# EAGLE design V100_Roco_68826_21MTC_J2_029_01_04 (EAGLE 5.10)
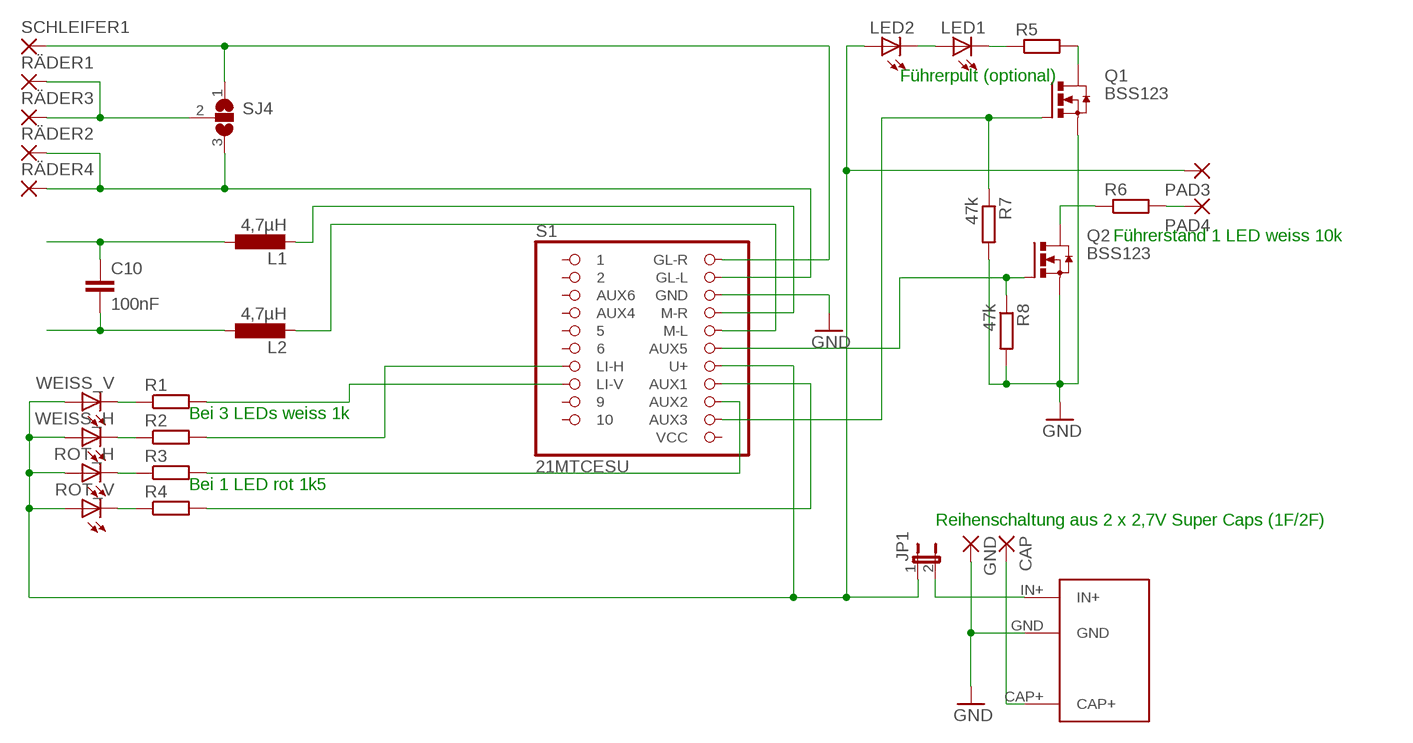
[diagram p0: schematic, sheet 1]

## Parts
C10  100nF  C-EUC0603  [C0603]
CAP  SMD2  [SMD1,27-2,54]
GND  SMD2  [SMD1,27-2,54]
JP1  JP1E2,00  [JP1_2]
L1  4,7µH  L-EUL1212W  [L1212W]
L2  4,7µH  L-EUL1212W  [L1212W]
LED1  LEDCHIPLED_0603  [CHIPLED_0603]
LED2  LEDCHIPLED_0603  [CHIPLED_0603]
PAD3  SMD-LONG1,27-1,9  [SMD1,27-1,9]
PAD4  SMD-LONG1,27-1,9  [SMD1,27-1,9]
Q1  BSS123  N-HEXFET_SOT23-  [SOT23]
Q2  BSS123  N-HEXFET_SOT23-  [SOT23]
R1  R-EU_R0603  [R0603]
R2  R-EU_R0603  [R0603]
R3  R-EU_R0603  [R0603]
R4  R-EU_R0603  [R0603]
R5  R-EU_R0603  [R0603]
R6  R-EU_R0603  [R0603]
R7  47k  R-EU_R0603  [R0603]
R8  47k  R-EU_R0603  [R0603]
ROT_H  LG_T679-F1G2-1  [PLCC2]
ROT_V  LG_T679-F1G2-1  [PLCC2]
RÄDER1  SMD2  [SMD1,27-2,54]
RÄDER2  SMD2  [SMD1,27-2,54]
RÄDER3  SMD2  [SMD1,27-2,54]
RÄDER4  SMD2  [SMD1,27-2,54]
S1  21MTCESU  [21MTC_SMD_ESU]
SCHLEIFER1  SMD2  [SMD1,27-2,54]
SJ4  SJ2W  [SJ_2]
U$3  PWR_CAPT  [POWER_CAP]
WEISS_H  LG_T679-F1G2-1  [PLCC2]
WEISS_V  LG_T679-F1G2-1  [PLCC2]

## Nets
AUX1: R4.2 S1.P15(AUX1)
AUX2: R3.2 S1.P14(AUX2)
AUX3: Q1.3(D) R5.2
AUX5: Q2.1(G) R8.1 S1.P17(AUX5)
BLAU: C10.1 L1.1
CAP: CAP.1(P) U$3.CAP+
GELB: R2.2 S1.P7(LI-H)
GND: GND.1(P) Q1.2(S) Q2.2(S) R7.2 R8.2 S1.P20(GND) U$3.GND
GRAU: R1.2 S1.P8(LI-V)
GRÜN: C10.2 L2.1
IN: JP1.2 U$3.IN+
N$1: R1.1 WEISS_V.C
N$2: R2.1 WEISS_H.C
N$3: R3.1 ROT_H.C
N$4: R4.1 ROT_V.C
N$6: LED1.A LED2.C
N$7: LED1.C R5.1
N$8: Q1.1(G) R7.1 S1.P13(AUX3)
N$9: Q2.3(D) R6.1
N$10: PAD4.1(P) R6.2
N$22: L2.2 S1.P18(M-L)
N$23: L1.2 S1.P19(M-R)
ORANGE: JP1.1 LED2.A PAD3.1(P) ROT_H.A ROT_V.A S1.P16(U+) WEISS_H.A WEISS_V.A
RÄDER: RÄDER2.1(P) RÄDER4.1(P) S1.P21(GL-L) SJ4.3
RÄDER2: RÄDER1.1(P) RÄDER3.1(P) SJ4.2
SCHLEIFER: S1.P22(GL-R) SCHLEIFER1.1(P) SJ4.1
Unconnected: S1.P1 S1.P2 S1.P3(AUX6) S1.P4(AUX4) S1.P5 S1.P6 S1.P9 S1.P10

## Notes on the sheet
- Führerpult (optional)
- Führerstand 1 LED weiss 10k
- Bei 3 LEDs weiss 1k
- Bei 1 LED rot 1k5
- Reihenschaltung aus 2 x 2,7V Super Caps (1F/2F)

## Power pins joined to a net without a drawn wire
VCC: S1.P12(VCC)

## Library data of the parts
C10 = rcl:C-EU: CAPACITOR, European symbol
CAP GND RÄDER1-RÄDER4 SCHLEIFER1 = wirepad:SMD2: SMD PAD
JP1 = jumper:JP1E: JUMPER
L1 L2 = rcl:L-EU: INDUCTOR, European symbol
LED1 LED2 = led:LED: LED OSRAM: - CHIPLED LG R971, LG N971, LY N971, LG Q971, LY Q971, LO R971, LY R971 LH N974, LH R974 LS Q976, LO Q976, LY Q976 LO Q996 - Hyper CHIPLED LW Q18S LB Q993, LB Q99A, LB R99A - SideLED LS A670, LO A670, LY A670, LG A670, LP A670 LB A673, LV A673, LT A673, LW A673 LH A674 LY A675 LS A676, LA A676, LO A676, LY A676, LW A676 LS A679, LY A679, LG A679 - Hyper Micro SIDELED® LS Y876, LA Y876, LO Y876, LY Y876 LT Y87S - SmartLED LW L88C, LW L88S LB L89C, LB L89S, LG L890 LS L89K, LO L89K, LY L89K LS L896, LA L896, LO L896, LY L896 - TOPLED LS T670, LO T670, LY T670, LG T670, LP T670 LSG T670, LSP T670, LSY T670, LOP T670, LYG T670 LG T671, LOG T671, LSG T671 LB T673, LV T673, LT T673, LW T673 LH T674 LS T676, LA T676, LO T676, LY T676, LB T676, LH T676, LSB T676, LW T676 LB T67C, LV T67C, LT T67C, LS T67K, LO T67K, LY T67K, LW E67C LS E67B, LA E67B, LO E67B, LY E67B, LB E67C, LV E67C, LT E67C LW T67C LS T679, LY T679, LG T679 LS T770, LO T770, LY T770, LG T770, LP T770 LB T773, LV T773, LT T773, LW T773 LH T774 LS E675, LA E675, LY E675, LS T675 LS T776, LA T776, LO T776, LY T776, LB T776 LHGB T686 LT T68C, LB T68C - Hyper Mini TOPLED® LB M676 - Mini TOPLED Santana® LG M470 LS M47K, LO M47K, LY M47K Source: http://www.osram.convergy.de LUXEON: - LUMILED® LXK2-PW12-R00, LXK2-PW12-S00, LXK2-PW14-U00, LXK2-PW14-V00 LXK2-PM12-R00, LXK2-PM12-S00, LXK2-PM14-U00 LXK2-PE12-Q00, LXK2-PE12-R00, LXK2-PE12-S00, LXK2-PE14-T00, LXK2-PE14-U00 LXK2-PB12-K00, LXK2-PB12-L00, LXK2-PB12-M00, LXK2-PB14-N00, LXK2-PB14-P00, LXK2-PB14-Q00 LXK2-PR12-L00, LXK2-PR12-M00, LXK2-PR14-Q00, LXK2-PR14-R00 LXK2-PD12-Q00, LXK2-PD12-R00, LXK2-PD12-S00 LXK2-PH12-R00, LXK2-PH12-S00 LXK2-PL12-P00, LXK2-PL12-Q00, LXK2-PL12-R00 Source: www.luxeon.com KINGBRIGHT: KA-3528ASYC Source: www.kingbright.com
PAD3 PAD4 = wirepad:SMD-LONG
Q1 Q2 = transistor-power:N-HEXFET_?-*: HEXFET® Power MOSFET
R1-R8 = rcl:R-EU_: RESISTOR, European symbol
ROT_H ROT_V WEISS_H WEISS_V = led:*_T679-?-1: LC TOPLED® Low Current LED Source: http://catalog.osram-os.com .. LG_LS_LY_T679_OBS.pdf; COLOR: green
S1 = pinhead:21MTC
SJ4 = jumper:SJ2W: SMD solder JUMPER
U$3 = pinhead:PWR_CAP

## Board
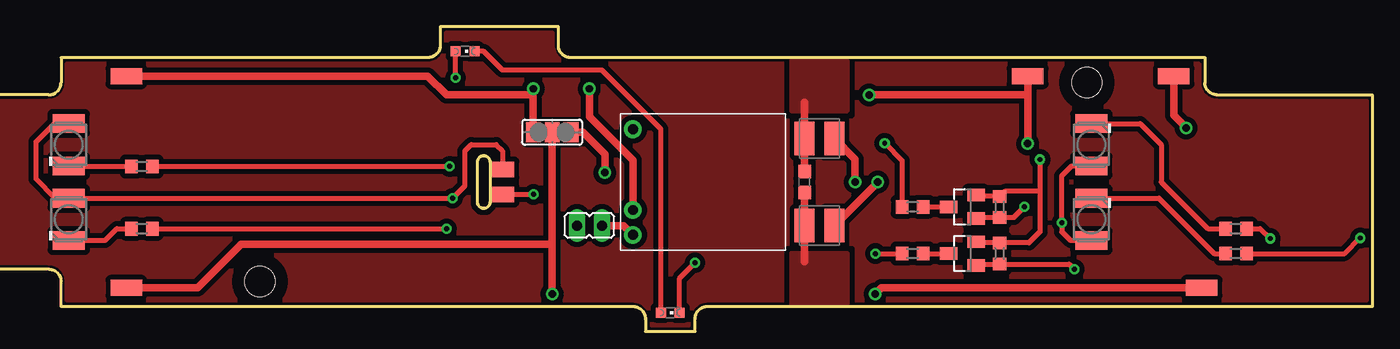
[diagram p1: board, top side]
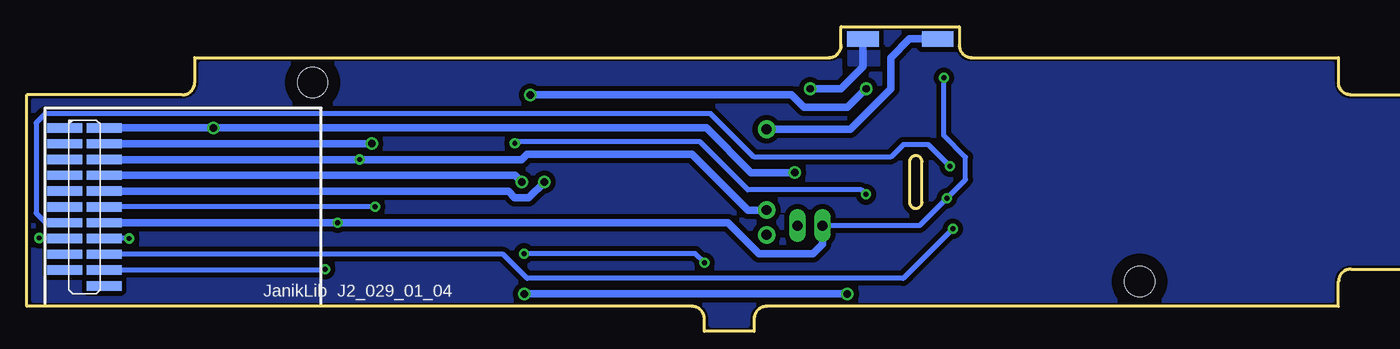
[diagram p2: board, bottom side, seen from below]

No outline drawn. Coordinates in mm, seen from the top.
Copper layers (1*16): Top 0.035mm / dielectric 1.5mm / Bottom 0.035mm
Design rules "default *": minimum track width 10mil, minimum drill 0.4mm, track to track 8mil, track to pad 8mil, pad to pad 8mil, via to via 8mil, smd to smd 8mil, copper to edge 40mil, drill to drill 8mil, minimum pad ring 10mil, minimum via ring 8mil, stop-mask expansion 4mil, vias tented up to drill 0mil, thermal gap 10mil
Holes 2.4 mm at 23.5,2 90,18
bKeepout: area 74,0 to 88,2.5; area 103,16 to 113,20; area 74,16 to 97,20
tRestrict: area 41,7.9 to 42,12.1
bRestrict: area 41,7.9 to 42,12.1
Milling: 31 lines

### Footprints (pad centres in the part's own frame; a part is rotated, then mirrored left to right if it is on the bottom)
C0603 = smd 1.1 x 1: 1 -0.85,0; 2 0.85,0
SMD1,27-2,54 = smd 1.27 x 2.54: 1 0,0
JP1_2 = drill 0.8 long: 1 0,-1; 2 0,1
L1212W = smd 1.6 x 2.7: 1 -1.2,0; 2 1.2,0
CHIPLED_0603 = smd 0.8 x 0.8: A 0,-0.75; C 0,0.75
SMD1,27-1,9 = smd 1.27 x 1.905: 1 0,0
SOT23 = smd 1 x 1.4: 1 -0.95,-1.1; 2 0.95,-1.1; 3 0,1.1
R0603 = smd 1 x 1.1: 1 -0.85,0; 2 0.85,0
PLCC2 = smd 2.6 x 1.5: A 0,1.7; C 0,-1.7
21MTC_SMD_ESU = smd 0.75 x 2.8: P1 -6.35,-0.953; P2 -5.08,-0.953; P3 -3.81,-0.953; P4 -2.54,-0.953; P5 -1.27,-0.953; P6 0,-0.953; P7 1.27,-0.953; P8 2.54,-0.953; P9 3.81,-0.953; P10 5.08,-0.953; P12 6.35,2.223; P13 5.08,2.223; P14 3.81,2.223; P15 2.54,2.223; P16 1.27,2.223; P17 0,2.223; P18 -1.27,2.223; P19 -2.54,2.223; P20 -3.81,2.223; P21 -5.08,2.223; P22 -6.35,2.223
SJ_2 = smd 1.168 x 1.6: 1 -1.524,0; 2 0,0; 3 1.524,0
POWER_CAP = drill 0.8 pad 1.422 round: CAP+ 0,-6.5; GND 0,0; IN+ 0,2

### Placement (x,y rotation side)
C10  67.3,10 90 top
CAP  39.75,21.5 270 bottom
GND  45.75,21.5 270 bottom
JP1  50,6.5 270 top
L1  68.5,6.5 0 top
L2  68.5,13.5 0 top
LED1  56.5,-0.5 270 top
LED2  40,20.5 270 top
PAD3  43,11 90 top
PAD4  43,9 90 top
Q1  80,4.25 90 top
Q2  80,8 90 top
R1  102,4.25 0 top
R2  14,11.25 0 top
R3  14,6.25 0 top
R4  102,6.25 0 top
R5  76,4.25 0 top
R6  76,8 180 top
R7  83,4.25 90 top
R8  83,8 90 top
ROT_H  8.12,7 0 top
ROT_V  90.38,13 180 top
RÄDER1  12.75,1.5 90 top
RÄDER2  12.75,18.5 90 top
RÄDER3  99.25,1.5 90 top
RÄDER4  85.25,18.5 90 top
S1  109,8 270 bottom
SCHLEIFER1  97,18.5 270 top
SJ4  47,14 180 top
U$3  53.5,7.75 180 top
WEISS_H  8.12,13 0 top
WEISS_V  90.38,7 180 top

### Tracks (layer width: path | path; a pad name or v marks a point on that pad's centre or on a via)
AUX1  (via drill 0.4)
  Top 0.406: v104.75,5.46 103.96,6.25 R4.2
  Bottom 0.406: v104.75,5.46 S1.P15
AUX2  (via drill 0.4)
  Top 0.406: R3.2 v38.5,6.25
  Bottom 0.406: v38.5,6.25 42.5,2.25 72.75,2.25 74.69,4.19 S1.P14
AUX3
  Top 0.406: R5.2 Q1.3
AUX5  (via drill 0.4)
  Top 0.406: Q2.1 81.2,7.15 R8.1 84.15,7.15 v85,8
  Bottom 0.406: v85,8 S1.P17
BLAU
  Top 0.61: 67.3,3.58 L1.1 C10.1
  pour Top (isolate 0.406): 70.75,4.25 66.25,4.25 66.25,0.25 70.75,0.25
CAP
  Bottom 0.61: CAP.1 42,21.5 43.5,20 43.5,17.5 46.75,14.25 U$3.CAP+
GELB  (via drill 0.4)
  Top 0.406: R2.2 v38.75,11.25
  Bottom 0.406: v38.75,11.25 40.5,13 42.5,13 43.5,12 54.5,12 58,15.5 111.5,15.5 112.25,14.75 112.25,7.5 111.48,6.73 S1.P7
GND  (via drill 0.4, 0.6)
  Top 0.406: Q1.2 81.2,5.1 R7.2 85.35,5.1 86.25,6 86.25,9.25 | v86.25,11.81 86.25,9.25 | Q2.2 81.2,8.85 R8.2 83.4,9.25 86.25,9.25
  Top 0.61: U$3.GND 53.5,11.75 50,15.25 v50,17.5
  Bottom 0.61: GND.1 45.75,19.25 47.5,17.5 v50,17.5 | U$3.GND 55,7.75 59.5,12.25 72.75,12.25 73.19,11.81 v86.25,11.81 S1.P20
  pour Bottom: 44.62,22 44.62,20.88 44.5,20.75 44.5,19.38 46.88,19.38 46.88,22
GRAU  (via drill 0.4)
  Top 0.406: v112,5.5 110.75,4.25 R1.2
  Bottom 0.406: S1.P8 109.49,5.5 v112,5.5
GRÜN
  Top 0.61: 67.3,16.43 L2.1 C10.2
  pour Top (isolate 0.406): 66.25,15.75 70.75,15.75 70.75,19.75 66.25,19.75
IN
  Top 0.61: JP1.2 52.75,6.5 U$3.IN+
N$1
  Top 0.406: R1.1 100.25,4.25 95.8,8.7 WEISS_V.C
N$2
  Top 0.406: WEISS_H.C 8.18,11.25 R2.1
N$3
  Top 0.406: 8.18,5.25 ROT_H.C 11.05,5.3 12,6.25 R3.1
N$4
  Top 0.406: 90.33,14.75 ROT_V.C 94.3,14.7 96,13 96,10 99.75,6.25 R4.1
N$5
  pour Top (isolate 0.406, rank 2): 0.5,3.5 0.5,16.5 6.5,16.5 arc90 8,18 8,19.5 37,19.5 arc90 38.5,21 38.5,22 47,22 47,21 arc90 48.5,19.5 99,19.5 99,18 arc90 100.5,16.5 112.5,16.5 112.5,0.5 59.5,0.5 arc90 58,-1 58,-1.5 55,-1.5 55,-1 arc90 53.5,0.5 8,0.5 8,2 arc90 6.5,3.5
  pour Bottom (isolate 0.406, rank 2): 0.5,3.5 0.5,16.5 6.5,16.5 arc90 8,18 8,19.5 37,19.5 arc90 38.5,21 38.5,22 47,22 47,21 arc90 48.5,19.5 99,19.5 99,18 arc90 100.5,16.5 112.5,16.5 112.5,0.5 59.5,0.5 arc90 58,-1 58,-1.5 55,-1.5 55,-1 arc90 53.5,0.5 8,0.5 8,2 arc90 6.5,3.5
N$6
  Top 0.406: LED2.C 41.5,20.5 43,19 51,19 55.75,14.25 LED1.A
N$7  (via drill 0.4)
  Top 0.406: v58.5,3.5 57.25,2.25 LED1.C | v73,4.25 R5.1
  Bottom 0.406: v58.5,3.5 59.25,4.25 v73,4.25
N$8  (via drill 0.4)
  Top 0.406: v89,3 88.6,3.4 R7.1 81.2,3.4 Q1.1
  Bottom 0.406: S1.P13 89.08,2.92 v89,3
N$9
  Top 0.406: R6.1 Q2.3
N$10  (via drill 0.4)
  Top 0.406: PAD4.1 v45.5,9 | R6.2 75.15,11.72 v73.75,13.12
  Bottom 0.406: v45.5,9 45.88,9.38 55,9.38 58.88,13.25 73.62,13.25 v73.75,13.12
N$22  (via drill 0.6)
  Top 0.61: v71.38,10 71.38,11.82 L2.2
  Bottom 0.61: S1.P18 74.27,9.27 73.75,8.75 72.62,8.75 v71.38,10
N$23  (via drill 0.6)
  Top 0.61: L1.2 v73.2,10
  Bottom 0.61: v73.2,10 73.74,10.54 S1.P19
ORANGE  (via drill 0.4)
  Top 0.406: WEISS_H.A 6.95,14.7 5.5,13.25 5.5,10.25 7.05,8.7 ROT_H.A v39,8.7 40,9.7 40,12.5 40.5,13 42.5,13 43,12.5 PAD3.1 | ROT_V.A 88.8,11.3 88,10.5 v88,6.73 88,6 88.7,5.3 WEISS_V.A | v39.25,18.38 LED2.A
  Bottom 0.406: v39.25,18.38 39.25,13.75 37.5,12 37.5,10.2 v39,8.7 41.2,6.5 JP1.1
  Bottom 0.61: S1.P16 v88,6.73 56.6,6.73 54.12,4.25 49.75,4.25 49,5 JP1.1
RÄDER  (via drill 0.6)
  Top 0.61: 45.48,17 SJ4.3 | RÄDER2.1 37,18.5 38.5,17 45.48,17 | 45.48,17 v45.48,17.5 | 85.25,17 v85.25,13.08 | v72.5,17 85.25,17 | 85.25,17 RÄDER4.1
  Bottom 0.61: v45.48,17.5 45.5,17.5 47,16 50.5,16 51.5,17 v72.5,17 | v85.25,13.08 S1.P21
RÄDER2  (via drill 0.6)
  Top 0.61: 47,5 v47,1 | RÄDER1.1 18.5,1.5 22,5 47,5 | 47,5 SJ4.2 | RÄDER3.1 73.5,1.5 v73,1
  Bottom 0.61: v47,1 v73,1
SCHLEIFER  (via drill 0.6)
  Top 0.61: SJ4.1 49.5,14 51.25,12.25 v51.25,10.75 | SCHLEIFER1.1 97,15.35 v98,14.35
  Bottom 0.61: v51.25,10.75 54.75,10.75 58.35,14.35 v98,14.35 S1.P22

### Text on the board
bNames: JanikLib J2_029_01_04
tStop: Rad1 | Rad1 | Roco 68826 | Schleifer | W | V100 21MTC | R | design by Janik Merz | + | AC | DC | R | W | CAP | Rad2 | Rad2
bStop: CAP+ | GND | 21MTC